# Altium schematic sheet SCH_01_Block_Diagram.SchDoc
size A4; DrawnBy: Phung Nhat Minh; SheetNumber: 1; SheetTotal: 7
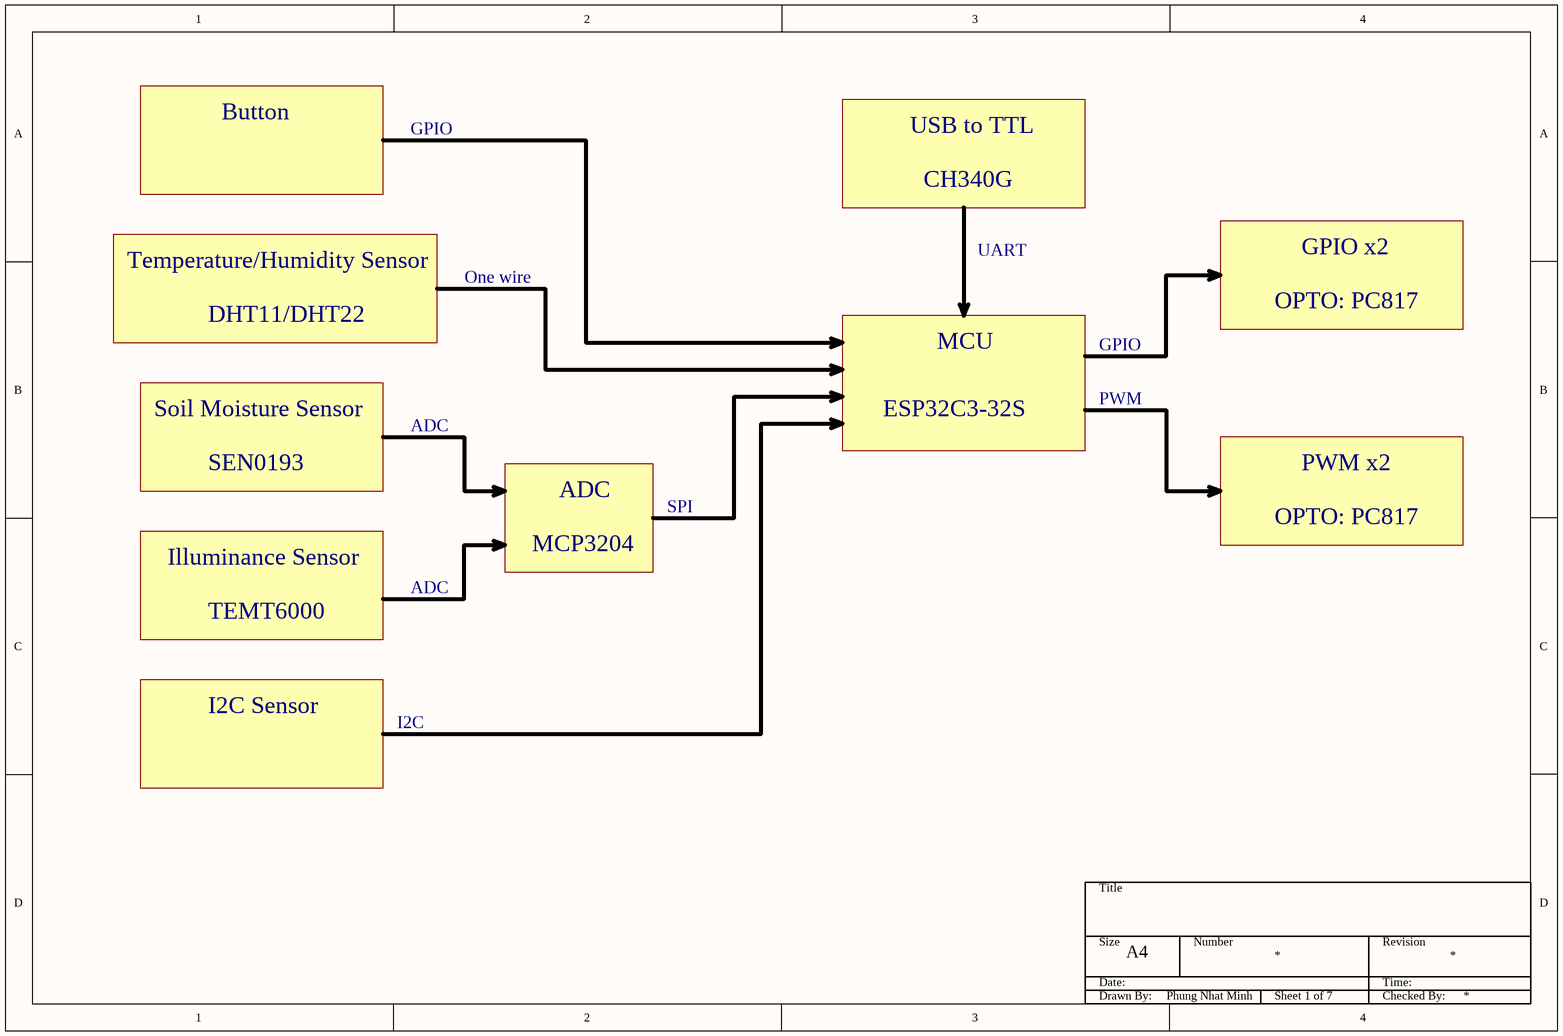
[diagram p0: SCH_01_Block_Diagram.SchDoc]

## Notes on the sheet
- Button
- GPIO
- USB to TTL
- CH340G
- Temperature/Humidity Sensor
- One wire
- UART
- OPTO: PC817
- GPIO x2
- DHT11/DHT22
- MCU
- Soil Moisture Sensor
- ADC
- ESP32C3-32S
- PWM
- SEN0193
- SPI
- PWM x2
- Illuminance Sensor
- MCP3204
- TEMT6000
- I2C Sensor
- I2C
- Title
- Size
- Date:
- A4
- Number
- Revision
- Time:
- Drawn By:
- Checked By: